# EAGLE design OnOnfre_DevBoard (EAGLE 9.1.3)
CNAME: BH ONOFRE; CREVISION: 5.1; DESIGNER: BrunoHorta
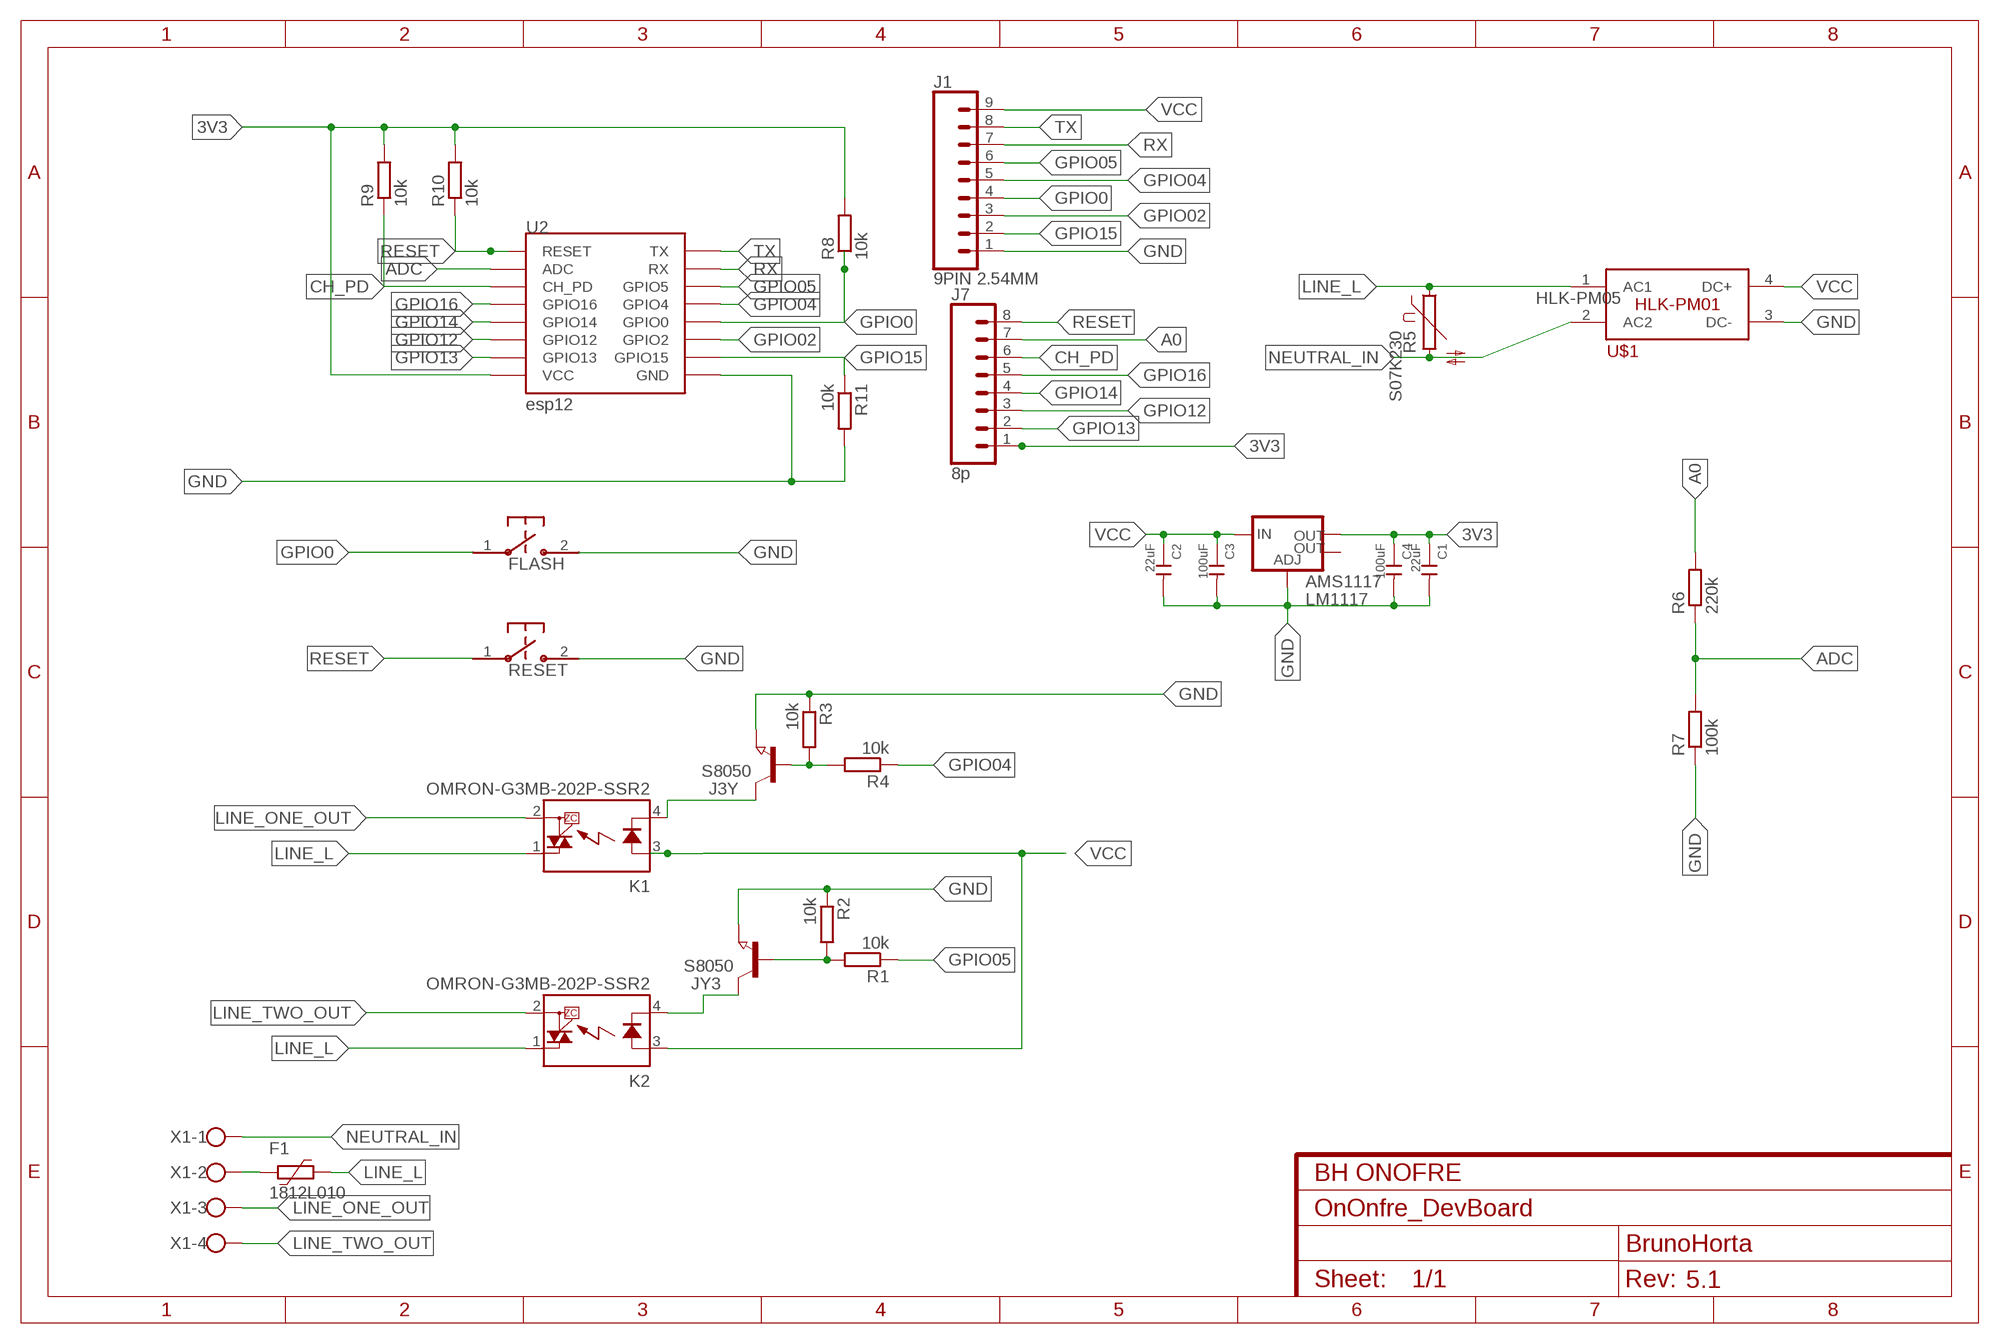
[diagram p0: schematic, sheet 1]

## Parts
AMS1117  LM1117  V_REG_LM1117SOT223  [SOT223]
C1  22uF  CERAMIC-1NF-1KV-10%-X7R(1206)  [C1206]
C2  22uF  CERAMIC-1NF-1KV-10%-X7R(1206)  [C1206]
C3  100uF  CERAMIC-1NF-1KV-10%-X7R(1206)  [C1206]
C4  100uF  CERAMIC-1NF-1KV-10%-X7R(1206)  [C1206]
F1  1812L010  [1812L]
FLASH  B3U-1000P-2P-SMD  B3U-1000P  [B3U-1000P]
J1  9PIN 2.54MM  CONN_09  [1X09]
J3Y  S8050  NPN-TRANSISTOR_SOT23  [SOT23]
J7  8p  CONN_08"  [1X08]
JY3  S8050  NPN-TRANSISTOR_SOT23  [SOT23]
K1  OMRON-G3MB-202P-SSR2  [OMRON-G3MB-202P-SSR]
K2  OMRON-G3MB-202P-SSR2  [OMRON-G3MB-202P-SSR]
R1  10k  R-EU_R0603  [R0603]
R2  10k  R-EU_R0603  [R0603]
R3  10k  R-EU_R0603  [R0603]
R4  10k  R-EU_R0603  [R0603]
R5  S07K230  [S07K230]
R6  220k  R-EU_R0603  [R0603]
R7  100k  R-EU_R0603  [R0603]
R8  10k  R-EU_R0603  [R0603]
R9  10k  R-EU_R0603  [R0603]
R10  10k  R-EU_R0603  [R0603]
R11  10k  R-EU_R0603  [R0603]
RESET  B3U-1000P-2P-SMD  B3U-1000P  [B3U-1000P]
U2  esp12  ESP12SMD  [ESP12-SMD]
U$1  HLK-PM01  [HLK-PM01]
X1  W237-4  [W237-4]

## Nets
3V3: AMS1117.2(OUT) C1.1 C4.1 J7.1 R8.2 R9.2 R10.2 U2.VCC
A0: J7.7 R6.2
ADC: R6.1 R7.2 U2.ADC
CH_PD: J7.6 R9.1 U2.CH_PD
GND: AMS1117.1(ADJ) C1.2 C2.2 C3.2 C4.2 FLASH.2 J1.1 J3Y.2(E) JY3.2(E) R2.1 R3.1 R7.1 R11.2 RESET.2 U2.GND U$1.3(DC-)
GPIO0: FLASH.1 J1.4 R8.1 U2.GPIO0
GPIO02: J1.3 U2.GPIO2
GPIO04: J1.5 R4.1 U2.GPIO4
GPIO05: J1.6 R1.1 U2.GPIO5
GPIO12: J7.3 U2.GPIO12
GPIO13: J7.2 U2.GPIO13
GPIO14: J7.4 U2.GPIO14
GPIO15: J1.2 R11.1 U2.GPIO15
GPIO16: J7.5 U2.GPIO16
LINE_L [220V]: F1.1 K1.1(DS1) K2.1(DS1) R5.1 U$1.1(AC1)
LINE_ONE_OUT [220V]: K1.2(DS2) X1.3
LINE_TWO_OUT [220V]: K2.2(DS2) X1.4
N$1: J3Y.3(C) K1.4(K)
N$2: F1.2 X1.2
N$7: J3Y.1(B) R3.2 R4.2
N$9: JY3.3(C) K2.4(K)
N$13: JY3.1(B) R1.2 R2.2
NEUTRAL_IN [220V]: R5.2 U$1.2(AC2) X1.1
RESET: J7.8 R10.1 RESET.1 U2.RESET
RX: J1.7 U2.RXD0(RX)
TX: J1.8 U2.TXD0(TX)
VCC: AMS1117.3(IN) C2.1 C3.1 J1.9 K1.3(A) K2.3(A) U$1.4(DC+)
Unconnected: AMS1117.4(OUT)

## Notes on the sheet
- HLK-PM05

## Library data of the parts
AMS1117 = SparkFun-IC-Power:V_REG_LM1117: Voltage Regulator LM1117 Standard adjustable voltage regulator but in SMD form. Spark Fun Electronics SKU : COM-00595; PROD_ID: VREG-08170
C1-C4 = Seeed-Capacitor:CERAMIC-1NF-1KV-10%-X7R?(1206): 302010189; MPN: CC1206KKX7RCBB102; VALUE: 1NF
F1 = polyfuse-smd_10:?: Polyfuse Resettable PTC Source: http://www.littelfuse.com/products/resettable-ptcs.aspx; MF: Littelfuse; MPN: 1812L010; OC_FARNELL: 1822210; OC_NEWARK: 78R5551
FLASH RESET = switches:B3U: Switch; DIGIKEY: SW1020CT-ND; MANUFACTURER: Omron; MPN: B3U-1000P
J1 = SparkFun-Connectors:CONN_09: Multi connection point. Often used as Generic Header-pin footprint for 0.1 inch spaced/style header connections On any of the 0.1 inch spaced packages, you can populate with these: Break Away Headers - Straight <https://www.sparkfun.com/products/116> (PRT-00116) Break Away Male Headers - Right Angle <https://www.sparkfun.com/products/553> (PRT-00553) Female Headers <https://www.sparkfun.com/products/115> (PRT-00115) Break Away Headers - Machine Pin <https://www.sparkfun.com/products/117> (PRT-00117) Break Away Female Headers - Swiss Machine Pin <https://www.sparkfun.com/products/743> (PRT-00743) For SCREWTERMINALS and SPRING TERMINALS visit here: Screw Terimnals on SparkFun.com <https://www.sparkfun.com/search/results?term=Screw+Terminals> (5mm/3.5mm/2.54mm spacing) This device is also useful as a general connection point to wire up your design to another part of your project. Our various solder wires solder well into these plated through hole pads. Hook-Up Wire - Assortment (Stranded, 22 AWG) <https://www.sparkfun.com/products/11375> (PRT-11375) Hook-Up Wire - Assortment (Solid Core, 22 AWG) <https://www.sparkfun.com/products/11367> (PRT-11367) View the entire wire category on our website here <https://www.sparkfun.com/categories/141> Special notes: Molex polarized connector foot print use with SKU : PRT-08231 with associated crimp pins and housings. 1MM SMD Version SKU: PRT-10208 NOTES ON THE VARIANTS LOCK and LOCK_LONGPADS... This footprint was designed to help hold the alignment of a through-hole component (i.e. 6-pin header) while soldering it into place. You may notice that each hole has been shifted either up or down by 0.005 of an inch from it's more standard position (which is a perfectly straight line). This slight alteration caused the pins (the squares in the middle) to touch the edges of the holes. Because they are alternating, it causes a "brace" to hold the component in place. 0.005 has proven to be the perfect amount of "off-center" position when using our standard breakaway headers. Although looks a little odd when you look at the bare footprint, once you have a header in there, the alteration is very hard to notice. Also,if you push a header all the way into place, it is covered up entirely on the bottom side.
J3Y JY3 = semicon-smd-ipc:NPN-TRANSISTOR_: NPN TRANSISTOR
J7 = SparkFun-Connectors:CONN_08: Multi connection point. Often used as Generic Header-pin footprint for 0.1 inch spaced/style header connections On any of the 0.1 inch spaced packages, you can populate with these: Break Away Headers - Straight <https://www.sparkfun.com/products/116> (PRT-00116) Break Away Male Headers - Right Angle <https://www.sparkfun.com/products/553> (PRT-00553) Female Headers <https://www.sparkfun.com/products/115> (PRT-00115) Break Away Headers - Machine Pin <https://www.sparkfun.com/products/117> (PRT-00117) Break Away Female Headers - Swiss Machine Pin <https://www.sparkfun.com/products/743> (PRT-00743) Arduino Stackable Header - 8 Pin <https://www.sparkfun.com/products/9279> (PRT-09279) For SCREWTERMINALS and SPRING TERMINALS visit here: Screw Terimnals on SparkFun.com <https://www.sparkfun.com/search/results?term=Screw+Terminals> (5mm/3.5mm/2.54mm spacing) This device is also useful as a general connection point to wire up your design to another part of your project. Our various solder wires solder well into these plated through hole pads. Hook-Up Wire - Assortment (Stranded, 22 AWG) <https://www.sparkfun.com/products/11375> (PRT-11375) Hook-Up Wire - Assortment (Solid Core, 22 AWG) <https://www.sparkfun.com/products/11367> (PRT-11367) View the entire wire category on our website here <https://www.sparkfun.com/categories/141> Special notes: Molex polarized connector foot print use with SKU : PRT-08231 with associated crimp pins and housings. 1MM SMD Version SKU: PRT-10208 NOTES ON THE VARIANTS LOCK and LOCK_LONGPADS... This footprint was designed to help hold the alignment of a through-hole component (i.e. 6-pin header) while soldering it into place. You may notice that each hole has been shifted either up or down by 0.005 of an inch from it's more standard position (which is a perfectly straight line). This slight alteration caused the pins (the squares in the middle) to touch the edges of the holes. Because they are alternating, it causes a "brace" to hold the component in place. 0.005 has proven to be the perfect amount of "off-center" position when using our standard breakaway headers. Although looks a little odd when you look at the bare footprint, once you have a header in there, the alteration is very hard to notice. Also,if you push a header all the way into place, it is covered up entirely on the bottom side.; PROD_ID: CONN-08438
K1 K2 = Omron G3MB 202p SSR:OMRON-G3MB-202P-SSR: IT(rms) 8A, Zero Cross type SIP 4pin Triac output SSR Source: http://sharp-world.com/products/device/lineup/data/pdf/datasheet/s102s02_e.pdf; MPN: S202S02F; OC_FARNELL: 1618475; OC_NEWARK: 14N9588
R1-R4 R6-R11 = resistor:R-EU_: RESISTOR, European symbol
R5 = VARISTORESBH:S07K230: VARISTOR
U2 = esp8266modules:ESP12: ESP8266 Wifi module 12
U$1 = HLK-PM01:HLK-PM01; AVAILABILITY: Unavailable; MF: Hi-link; MP: hlk-pm01; PACKAGE: Package Analog Devices; PRICE: None
X1 = con-wago-500:W237-4: WAGO SCREW CLAMP; OC_FARNELL: unknown; OC_NEWARK: unknown

## Net classes
1 220V: width 1.27 mm, clearance 2 mm

## Board
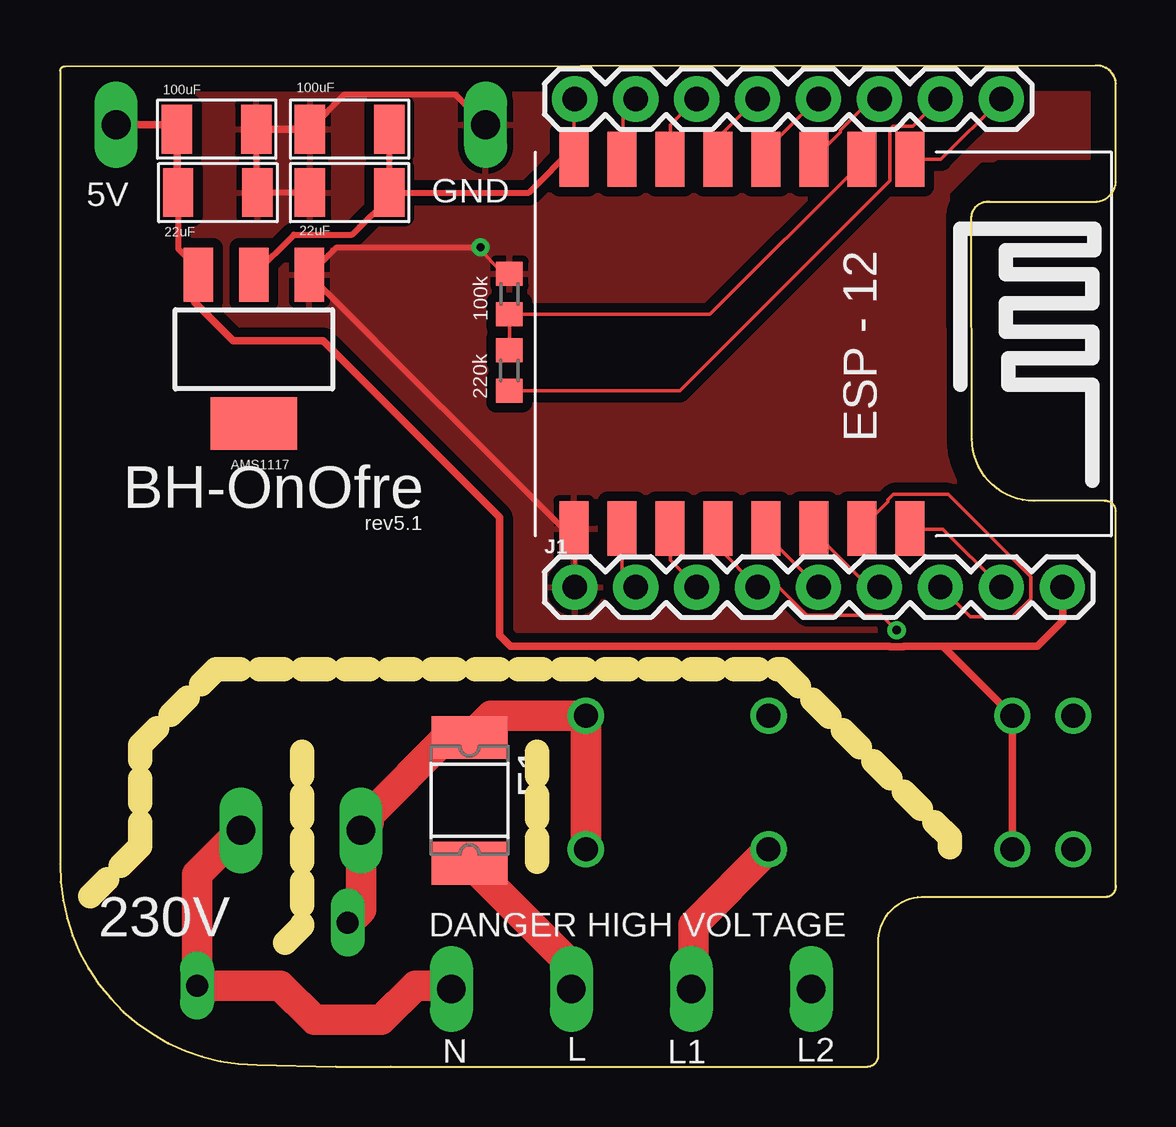
[diagram p1: board, top side]
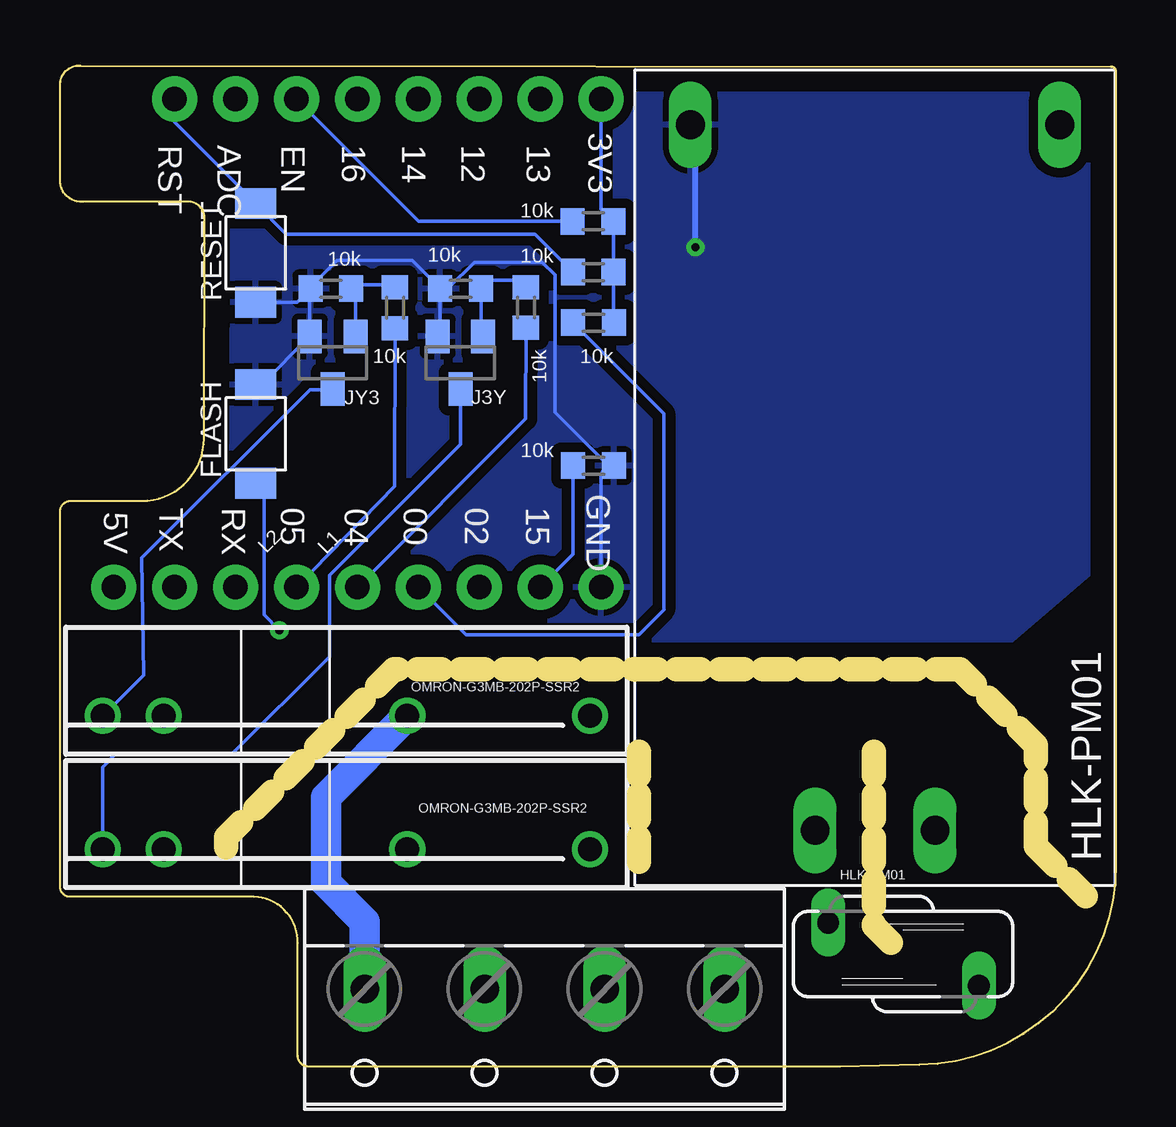
[diagram p2: board, bottom side, seen from below]

Size 44.02 x 41.71 mm. Coordinates in mm from the lower left corner, seen from the top.
Outline: 0,41.49 0,8.45 arc90 8.21,0.07 11.51,0 13.78,0 33.67,0 arc90 34.11,0.47 34.11,5.15 arc-90 35.93,7.07 43.64,7.08 arc90 44.02,7.56 44.02,23.16 arc90 43.53,23.57 40.61,23.57 arc-90 38.02,26.16 37.99,35.42 arc-90 38.75,36.04 43.07,36.03 arc90 44.02,36.87 44.02,40.96 arc90 43.16,41.71 0.22,41.67 arc90 0,41.49
Copper layers (1*16): Top 0.035mm / dielectric 1.5mm / Bottom 0.035mm
Design rules "default": minimum track width 6mil, minimum drill 0.35mm, track to track 6mil, track to pad 6mil, pad to pad 6mil, via to via 6mil, smd to smd 6mil, copper to edge 40mil, drill to drill 6mil, minimum pad ring 10mil, minimum via ring 8mil, stop-mask expansion 4mil, vias tented up to drill 0mil, thermal gap 10mil
Milling: 38 lines

### Footprints (pad centres in the part's own frame; a part is rotated, then mirrored left to right if it is on the bottom)
SOT223 = smd 1.219 x 2.235: 1 -2.311,-3.099; 2 0,-3.099; 3 2.311,-3.099 | smd 3.6 x 2.2: 4 0,3.099
C1206 = smd 1.27 x 2.032: 1 -1.651,0; 2 1.651,0
1812L = smd 1.78 x 3.15: 1 -2.62,0; 2 2.62,0
B3U-1000P = smd 1.283 x 1.7: 1 -2.056,0; 2 2.056,0
1X09 = drill 1.016 pad 1.88: 1 0,0; 2 2.54,0; 3 5.08,0; 4 7.62,0; 5 10.16,0; 6 12.7,0; 7 15.24,0; 8 17.78,0; 9 20.32,0
SOT23 = smd 1 x 1.4: 1 -0.95,-1.1; 2 0.95,-1.1; 3 0,1.1
1X08 = drill 1.016 pad 1.88: 1 0,0; 2 2.54,0; 3 5.08,0; 4 7.62,0; 5 10.16,0; 6 12.7,0; 7 15.24,0; 8 17.78,0
OMRON-G3MB-202P-SSR = drill 1: 1 -12.7,0; 2 -5.08,0; 3 5.08,0; 4 7.62,0
R0603 = smd 1 x 1.1: 1 -0.85,0; 2 0.85,0
S07K230 = drill 0.914 long: 1 -1.311,-3.121; 2 1.311,3.163
ESP12-SMD = smd 2.286 x 1.2: ADC -7.792,3.8; CH_PD -7.792,1.8; GND 7.592,-8.2; GPIO0 7.592,-2.2; GPIO2 7.592,-4.2; GPIO4 7.592,-0.2; GPIO5 7.592,1.8; GPIO12 -7.792,-4.2; GPIO13 -7.792,-6.2; GPIO14 -7.792,-2.2; GPIO15 7.592,-6.2; GPIO16 -7.792,-0.2; RESET -7.792,5.8; RXD0 7.592,3.8; TXD0 7.592,5.8; VCC -7.792,-8.2
HLK-PM01 = drill 1.2 long: 1 -14.7,2.5; 2 -14.7,-2.5; 3 14.7,7.7; 4 14.7,-7.7
W237-4 = drill 1.194 long: 1 -7.5,-1.27; 2 -2.5,-1.27; 3 2.5,-1.27; 4 7.5,-1.27

### Placement (x,y rotation side)
AMS1117  8.08,29.9 180 top
C1  12.08,36.42 180 top
C2  6.58,36.42 0 top
C3  6.54,39.06 0 top
C4  12.08,39.06 180 top
F1  17.07,11.1 270 top
FLASH  35.86,26.37 90 bottom
J1  21.46,19.98 0 top
J3Y  27.33,29.33 180 bottom
J7  21.46,40.32 0 top
JY3  32.66,29.33 180 bottom
K1  34.62,9.06 180 bottom
K2  34.62,14.61 180 bottom
R1  30.05,31.62 90 bottom
R2  32.72,32.42 0 bottom
R3  27.33,32.42 0 bottom
R4  24.6,31.63 90 bottom
R5  8.88,4.69 270 bottom
R6  18.73,29 270 top
R7  18.74,32.19 270 top
R8  21.78,31 0 bottom
R9  21.79,35.22 0 bottom
R10  21.79,33.11 0 bottom
R11  21.78,25.04 0 bottom
RESET  35.86,33.91 270 bottom
U2  29.62,30.01 270 top
U$1  10.04,24.54 90 bottom
X1  23.82,1.96 180 bottom

### Tracks (layer width: path | path; a pad name or v marks a point on that pad's centre or on a via)
3V3
  Top 0.152: U2.VCC 21.42,38.3 21.42,40.28 J7.1 | 13.72,37.01 13.72,36.56 C1.1 13.72,36.59 13.72,37.01
  Top 0.254: C4.1 13.73,36.59 13.72,36.59 | C1.1 13.94,36.42 | 13.94,36.42 19.54,36.42 21.42,38.3 | AMS1117.2 9.75,34.66 12.18,34.66 13.94,36.42
  Bottom 0.152: R8.2 R10.2 20.94,35.21 | 20.94,35.21 R9.2 | R9.2 | J7.1 21.46,35.73 20.94,35.21
A0
  Top 0.152: J7.7 35.56,39.18 34.73,39.18 34.59,39.04 34.59,36.91 25.84,28.15 R6.2
ADC
  Top 0.152: U2.ADC 33.42,37.67 27.09,31.34 R7.2 R6.1
CH_PD
  Top 0.152: U2.CH_PD 31.47,37.87 32.54,38.93 32.54,39.01 33.83,40.3 34.14,40.3 J7.6
  Bottom 0.152: R9.1 29.06,35.22 J7.6
GND  (via drill 0.35)
  Top 0.152: U2.GND arc-90 21.46,22.38 21.46,21.57 J1.1 | R7.1 18.5,33.04 17.4,34.14
  Top 0.254: C4.2 11.87,40.51 16.37,40.51 16.47,40.51 U$1.3 | C3.2 8.19,36.46 C2.2 C1.2 | v17.53,34.14 17.4,34.14 11.54,34.14 AMS1117.1 21.46,21.93 21.46,21.57
  Top 0.305: C3.2 C4.2
  Bottom 0.152: R2.1 33.61,32.45 JY3.2 35.61,28.42 FLASH.2 | J1.1 21.46,24.61 arc90 R11.2 21.18,25.06 23.39,27.27 23.39,32.99 23.93,33.52 26.75,33.52 27.81,32.45 28.12,32.45 R3.1 | R3.1 28.18,30.53 J3Y.2 | R3.1 28.19,32.45 29.34,33.6 32.46,33.6 33.53,32.53 R2.1 | RESET.2 34.14,31.85 R2.1
  Bottom 0.254: v17.53,34.14 17.53,39.03 U$1.3
  pour Bottom (isolate 0.406): 0.46,40.05 0.4,21.17 4.37,17.78 30.6,17.78 38.06,10.33 38.06,7.97 38.21,7.81 43.57,7.81 43.57,22.12 42.8,22.89 39.74,22.89 36.98,25.64 36.98,36.38 38.41,37.81 43.11,37.81 43.11,40.57 42.85,41.51 1.74,41.34 0.78,40.45
  pour Top (isolate 0.406): 0.44,39.96 0.44,21.45 4.37,17.52 30.86,17.52 30.91,17.47 38.11,10.27 38.11,7.76 38.21,7.66 43.62,7.66 43.62,22.07 42.8,22.89 42.75,22.94 39.79,22.94 36.98,25.75 36.98,36.43 38.36,37.81 38.92,37.81 39.03,37.91 43.06,37.91 43.06,41.44 43.01,41.49 1.92,41.49 0.44,40.01
GPIO0  (via drill 0.35)
  Top 0.152: v34.87,18.19 34.25,18.81 31.14,18.81 29.97,19.98 J1.4 27.42,21.64 U2.GPIO0
  Bottom 0.152: R8.1 18.84,27.21 18.84,19.04 19.89,17.99 27.09,17.99 J1.4 | FLASH.1 35.51,24.3 35.51,18.82 v34.87,18.19
GPIO02
  Top 0.152: U2.GPIO2 25.45,22.4 25.45,21.1 26.52,20.03 J1.3
GPIO04
  Top 0.152: U2.GPIO4 29.49,22.4 29.49,22.09 31.55,20.03 J1.5
  Bottom 0.152: R4.1 24.61,26.99 J1.5
GPIO05
  Top 0.152: U2.GPIO5 31.47,22.4 31.47,22.24 33.68,20.03 34.14,20.03 J1.6
  Bottom 0.152: R1.1 30.07,24.19 J1.6
GPIO12
  Top 0.152: U2.GPIO12 25.45,37.87 25.45,39.24 26.52,40.3 J7.3
GPIO13
  Top 0.152: U2.GPIO13 23.47,37.87 23.47,39.85 23.93,40.3 J7.2
GPIO14
  Top 0.152: U2.GPIO14 27.43,37.87 27.43,38.7 29.03,40.3 J7.4
GPIO15
  Top 0.152: U2.GPIO15 23.42,20.56 J1.2
  Bottom 0.152: R11.1 22.63,21.35 J1.2
GPIO16
  Top 0.152: U2.GPIO16 29.49,37.87 29.49,38.25 31.55,40.3 J7.5
LINE_L
  Top 1.27: K1.1 K2.1 17.97,14.61 F1.1 16.12,13.72 12.86,10.46 12.86,10.16 U$1.1 12.54,6.55 R5.1
LINE_ONE_OUT
  Top 1.27: K1.2 26.4,5.92 26.4,3.32 X1.3
LINE_TWO_OUT
  Bottom 1.27: K2.2 32.93,11.23 32.93,7.66 31.32,6.05 X1.4
N$1
  Bottom 0.152: J3Y.3 27.33,25.92 32.79,20.46 32.79,17.07 36.88,12.99 41.73,12.99 42.24,12.48 K1.4
N$2
  Top 1.27: F1.2 21.32,4.23 X1.2
N$7
  Bottom 0.152: J3Y.1 26.48,30.52 R3.2 26.44,32.45 26.14,32.76 24.61,32.76 R4.2
N$9
  Bottom 0.152: 33.23,28.2 33.59,28.21 40.6,21.2 40.54,16.3 42.22,14.62 K2.4 | 33.23,28.2 | 33.23,28.2 32.68,28.2 JY3.3
N$13
  Bottom 0.152: JY3.1 31.71,32.31 R2.2 31.7,32.38 31.66,32.59 30.44,32.59 R1.2
NEUTRAL_IN
  Top 1.27: U$1.2 5.71,8.02 R5.2 9.18,3.38 10.61,1.94 13.38,1.94 14.82,3.38 16.17,3.38 X1.1
RESET
  Top 0.152: U2.RESET 36.73,37.8 J7.8
  Bottom 0.152: R10.1 24.22,34.69 34.58,34.69 RESET.1 39.24,39.34 J7.8
RX
  Top 0.152: U2.RXD0 33.45,22.47 34.52,23.54 34.52,23.62 34.75,23.84 37.03,23.84 40.46,20.42 40.46,19.5 39.7,18.74 37.95,18.74 36.73,19.96 J1.7
TX
  Top 0.152: U2.TXD0 35.43,22.4 36.8,22.4 39.17,20.03 J1.8
VCC
  Top 0.152: AMS1117.3 5.77,33.23 5.73,33.28 | C3.1 4.88,39.38 C3.1
  Top 0.254: C2.1 4.93,34.08 5.73,33.28 | AMS1117.3 5.62,32.84 5.62,31.84
  Top 0.305: U$1.4 4.58,39.24 C3.1 4.88,36.46 C2.1 | 5.62,31.84 7.22,30.24 10.97,30.24 18.32,22.89 18.32,17.99 18.78,17.52 34.57,17.52 34.59,17.5 35.16,17.5 35.17,17.52 36.79,17.52 | 36.79,17.52 K2.3 K1.3 | 36.79,17.52 40.74,17.52 41.8,18.58 41.8,19.96 J1.9

### Text on the board
tNames: 5V | GND | BH-OnOfre | rev5.1 | 230V | DANGER HIGH VOLTAGE | L1 | N | L | L2
bNames: 3V3 | 13 | 12 | 14 | 16 | EN | ADC | RST | GND | 15 | 02 | 00 | 04 | 05 | RX | TX | 5V | L1 | L2 | HLK-PM01